# Altium project Jonathan ESC.PrjPcb
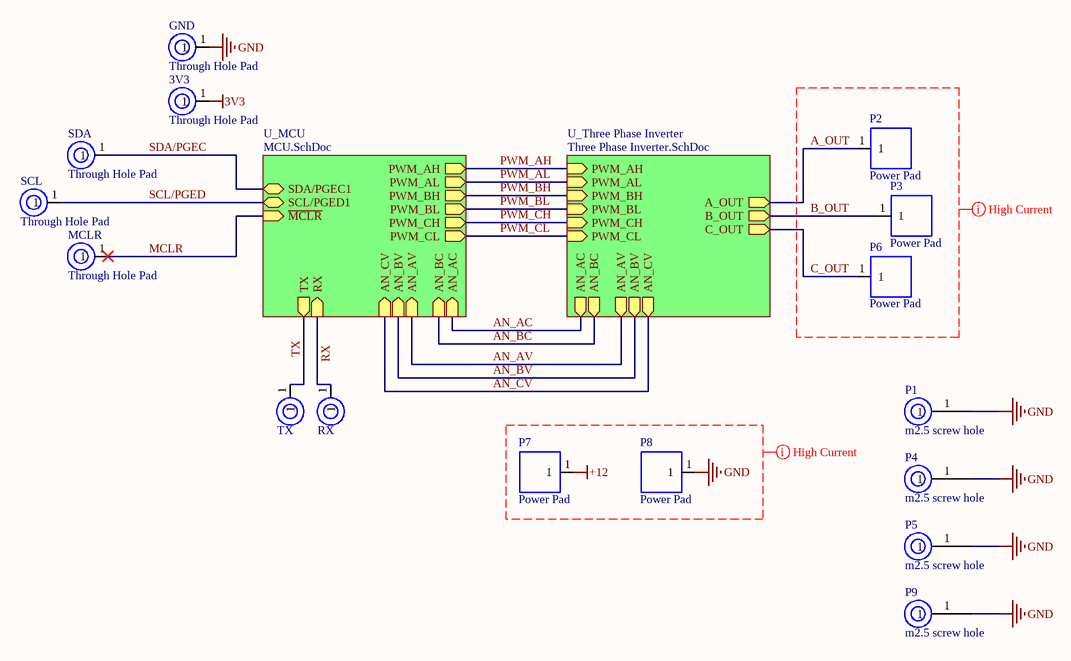
[diagram p0: Jonathan ESC.SchDoc]
3 sheets, 62 parts. Net scope: hierarchical (ports join the sheet entries above them; power ports are global).
Board file: Jonathan ESC.PcbDoc
Sheets:
  Jonathan ESC.SchDoc
    U_MCU = MCU.SchDoc
    U_Three Phase Inverter = Three Phase Inverter.SchDoc

## Sheet Jonathan ESC.SchDoc: Jonathan ESC Full
size A; Revision: 2.0; SheetNumber: 1; SheetTotal: 3

### Parts
3V3  Through Hole Pad  [THROUGH HOLE PAD]  (no BOM)
GND  Through Hole Pad  [THROUGH HOLE PAD]  (no BOM)
MCLR  Through Hole Pad  [THROUGH HOLE PAD]  (no BOM)
P1  m2.5 screw hole  [m2.5 screw hole]
P2  Power Pad  [Power Pad]  (no BOM)
P3  Power Pad  [Power Pad]  (no BOM)
P4  m2.5 screw hole  [m2.5 screw hole]
P5  m2.5 screw hole  [m2.5 screw hole]
P6  Power Pad  [Power Pad]  (no BOM)
P7  Power Pad  [Power Pad]  (no BOM)
P8  Power Pad  [Power Pad]  (no BOM)
P9  m2.5 screw hole  [m2.5 screw hole]
RX  RX  [THROUGH HOLE PAD]  (value not drawn)  (no BOM)
SCL  Through Hole Pad  [THROUGH HOLE PAD]  (no BOM)
SDA  Through Hole Pad  [THROUGH HOLE PAD]  (no BOM)
TX  TX  [THROUGH HOLE PAD]  (value not drawn)  (no BOM)

### Sub-sheets
U_MCU = MCU.SchDoc: SCL/PGED1 (bidir), SDA/PGEC1 (bidir), PWM_CL (out), PWM_AH (out), PWM_AL (out), PWM_BH (out), PWM_CH (out), PWM_BL (out), ~{MCLR} (in), AN_BV (in), AN_AV (in), AN_CV (in), AN_BC (in), AN_AC (in), TX (out), RX (in)
U_Three Phase Inverter = Three Phase Inverter.SchDoc: C_OUT (out), AN_AC (out), A_OUT (out), AN_BV (out), AN_BC (out), PWM_AL (in), B_OUT (out), PWM_BL (in), AN_CV (out), PWM_CL (in), PWM_AH (in), PWM_CH (in), AN_AV (out), PWM_BH (in)

### Nets
3V3: 3V3.1
+12: P7.1
GND: GND.1 P1.1 P4.1 P5.1 P8.1 P9.1
A_OUT: P2.1 ; sheet U_Three Phase Inverter/A_OUT
AN_AC: sheet U_MCU/AN_AC, sheet U_Three Phase Inverter/AN_AC
AN_AV: sheet U_MCU/AN_AV, sheet U_Three Phase Inverter/AN_AV
AN_BC: sheet U_MCU/AN_BC, sheet U_Three Phase Inverter/AN_BC
AN_BV: sheet U_MCU/AN_BV, sheet U_Three Phase Inverter/AN_BV
AN_CV: sheet U_MCU/AN_CV, sheet U_Three Phase Inverter/AN_CV
B_OUT: P3.1 ; sheet U_Three Phase Inverter/B_OUT
C_OUT: P6.1 ; sheet U_Three Phase Inverter/C_OUT
MCLR: MCLR.1 ; sheet U_MCU/~{MCLR}
PWM_AH: sheet U_MCU/PWM_AH, sheet U_Three Phase Inverter/PWM_AH
PWM_AL: sheet U_MCU/PWM_AL, sheet U_Three Phase Inverter/PWM_AL
PWM_BH: sheet U_MCU/PWM_BH, sheet U_Three Phase Inverter/PWM_BH
PWM_BL: sheet U_MCU/PWM_BL, sheet U_Three Phase Inverter/PWM_BL
PWM_CH: sheet U_MCU/PWM_CH, sheet U_Three Phase Inverter/PWM_CH
PWM_CL: sheet U_MCU/PWM_CL, sheet U_Three Phase Inverter/PWM_CL
RX: RX.1 ; sheet U_MCU/RX
SCL/PGED: SCL.1 ; sheet U_MCU/SCL/PGED1
SDA/PGEC: SDA.1 ; sheet U_MCU/SDA/PGEC1
TX: TX.1 ; sheet U_MCU/TX

### Layout directives
net class High Current: +12, A_OUT, B_OUT, C_OUT, GND

### Notes on the sheet
- Title
- Size:
- Date:
- A
- Number:
- Time:
- Revision:
- Sheet
- of
- File:

### Library data of the parts
RX TX = Through Hole Pad

## Sheet MCU.SchDoc: MCU
size A; Revision: 2.0; SheetNumber: 2; SheetTotal: 3
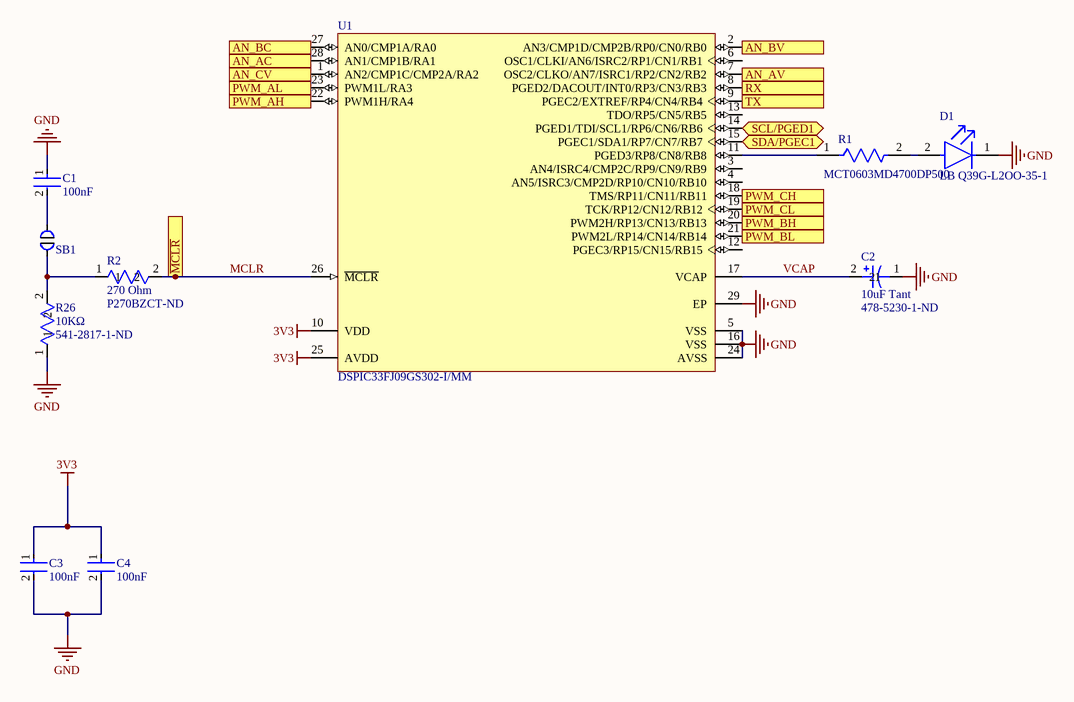
[diagram p1: MCU.SchDoc]

### Parts
C1  100nF  [FP-CL10-IPC_C]
C2  10uF Tant  Supplier Part Number 1: 478-5230-1-ND  [TPSB106K016R0500]
C3  100nF  [FP-CL10-IPC_C]
C4  100nF  [FP-CL10-IPC_C]
D1  LB Q39G-L2OO-35-1  [FP-LB_Q39G-MFG]
R1  MCT0603MD4700DP500  [FP-MCT0603-IPC_A]
R2  270 Ohm  Supplier Part Number 1: P270BZCT-ND  [ERJ-PA3J271V]
R26  10KΩ  Supplier Part Number 1: 541-2817-1-ND  [RCS060310K0JNEA]
SB1  Solder Bridge Open  [Solder Bridge Open]  (value not drawn)
U1  DSPIC33FJ09GS302-I/MM  [MCHP-QFN-S-MM28_M]

### Ports
AN_AC (in), AN_AV (in), AN_BC (in), AN_BV (in), AN_CV (in), PWM_AH (out), PWM_AL (out), PWM_BH (out), PWM_BL (out), PWM_CH (out), PWM_CL (out), RX (in), SCL/PGED1 (bidir), SDA/PGEC1 (bidir), TX (out), ~{MCLR} (in)

### Nets
3V3: C3.1 C4.1 U1.10(VDD) U1.25(AVDD)
GND: C1.1 C2.1 C3.2 C4.2 D1.1(C) R26.1 U1.5(VSS) U1.16(VSS) U1.24(AVSS) U1.29(EP)
AN_AC: U1.28(AN1/CMP1B/RA1) ; port AN_AC
AN_AV: U1.7(OSC2/CLKO/AN7/ISRC1/RP2/CN2/RB2) ; port AN_AV
AN_BC: U1.27(AN0/CMP1A/RA0) ; port AN_BC
AN_BV: U1.2(AN3/CMP1D/CMP2B/RP0/CN0/RB0) ; port AN_BV
AN_CV: U1.1(AN2/CMP1C/CMP2A/RA2) ; port AN_CV
MCLR: R2.2 U1.26(~{MCLR}) ; port ~{MCLR}
PWM_AH: U1.22(PWM1H/RA4) ; port PWM_AH
PWM_AL: U1.23(PWM1L/RA3) ; port PWM_AL
PWM_BH: U1.20(PWM2H/RP13/CN13/RB13) ; port PWM_BH
PWM_BL: U1.21(PWM2L/RP14/CN14/RB14) ; port PWM_BL
PWM_CH: U1.18(TMS/RP11/CN11/RB11) ; port PWM_CH
PWM_CL: U1.19(TCK/RP12/CN12/RB12) ; port PWM_CL
RX: U1.8(PGED2/DACOUT/INT0/RP3/CN3/RB3) ; port RX
SCL/PGED: U1.14(PGED1/TDI/SCL1/RP6/CN6/RB6) ; port SCL/PGED1
SDA/PGEC: U1.15(PGEC1/SDA1/RP7/CN7/RB7) ; port SDA/PGEC1
TX: U1.9(PGEC2/EXTREF/RP4/CN4/RB4) ; port TX
VCAP: C2.2 U1.17(VCAP)
NetC1_2: C1.2 SB1.1
NetD1_2: D1.2(A) R1.2
NetR1_1: R1.1 U1.11(PGED3/RP8/CN8/RB8)
NetR2_1: R2.1 R26.2 SB1.2

Not connected (* = marked no-connect by the designer): U1 3(AN4/ISRC4/CMP2C/RP9/CN9/RB9) 4(AN5/ISRC3/CMP2D/RP10/CN10/RB10) 6(OSC1/CLKI/AN6/ISRC2/RP1/CN1/RB1) 12(PGEC3/RP15/CN15/RB15) 13(TDO/RP5/CN5/RB5)

### Notes on the sheet
- Title
- Size:
- Date:
- A
- Number:
- Time:
- Revision:
- Sheet
- of
- File:

### Library data of the parts
C1 C3 C4 = CMP-13271-001724-1: Cap Ceramic 100nF 50V X7R ±20% Pad SMD 0603 +125°C T/R; Mount: Surface Mount; Lead Free: Lead Free; Max Operating Temperature: 125°C; Voltage Rating: 50V; Case Code (Imperial): 0603; Capacitance: 100nF; Height: 0.8mm; Length: 1.6mm; Tolerance: 20%; Case Code (Metric): 1608; Thickness: 0.035inch; Depth: 0.8mm; Width: 0.031inch; Package Quantity: 1; Min Operating Temperature: -55°C; Case/Package: 0603; Radiation Hardening: No; Voltage Rating (DC): 50V; Dielectric: X7R; Packaging: Tape and Reel
C2 = TPSB106K016R0500: CAP TANT 10UF 10% 16V SMD; Manufacturer: Kyocera AVX; Dielectric Material: Tantalum; ESR (Equivalent Series Resistance): 500mR; Leakage Current: 1.6uA; Polarity: Polar; Dissipation Factor: 6%; Supplier 1: Digi-Key; Manufacturer Part Number: TPSB106K016R0500; RoHS: Yes; Category: Tantalum Capacitors; Stock 1: 4; Pricing 1: 1=0.45000, 10=0.31900, 50=0.24140, 100=0.21030, 500=0.15580, 1000=0.13243 (USD); Mount: Surface Mount,PCB; Case/Package: 1210; Case Code (Metric): 3528; Case Code (Imperial): 1210; Min Operating Temperature: -55°C; Max Operating Temperature: 125°C; Capacitance: 10uF; Tolerance: 10%; Packaging: Tape and Reel; Package Quantity: 1; Voltage Rating: 16V; Voltage Rating (DC): 16V; Features: General Purpose; Termination: SMD/SMT; Voltage: 16V; Length: 3.5mm; Width: 0.11inch; Height: 1.9mm; Depth: 2.8mm; Height - Seated (Max): 0.083inch; Radiation Hardening: No; REACH SVHC: No SVHC; Lead Free: Lead Free; ComponentLink1URL: https://datasheet.ciiva.com/11793/0900766b80e0c35e-11793349.pdf?src-supplier=RSComponents; ComponentLink1Description: https://datasheet.ciiva.com/11793/0900766b80e0c35e-11793349.pdf?src-supplier=RSComponents; ComponentLink2URL: https://datasheet.ciiva.com/264/tps-264229.pdf?src-supplier=Digi-Key; ComponentLink2Description: https://datasheet.ciiva.com/264/tps-264229.pdf?src-supplier=Digi-Key; ComponentLink3URL: https://datasheet.ciiva.com/7730/1441576-7730869.pdf?src-supplier=Element14; ComponentLink3Description: https://datasheet.ciiva.com/7730/1441576-7730869.pdf?src-supplier=Element14; ComponentLink4URL: https://datasheet.ciiva.com/17339/tps-17339429.pdf?src-supplier=Avnet+Europe; ComponentLink4Description: https://datasheet.ciiva.com/17339/tps-17339429.pdf?src-supplier=Avnet+Europe; ComponentLink5URL: https://datasheet.ciiva.com/264/tps-264230.pdf?src-supplier=Digi-Key; ComponentLink5Description: https://datasheet.ciiva.com/264/tps-264230.pdf?src-supplier=Digi-Key; ComponentLink6URL: https://datasheet.ciiva.com/7730/1680477-7730870.pdf?src-supplier=Element14; ComponentLink6Description: https://datasheet.ciiva.com/7730/1680477-7730870.pdf?src-supplier=Element14; ComponentLink7URL: https://datasheet.ciiva.com/16500/tps-16500230.pdf?src-supplier=Future+Electronics; ComponentLink7Description: https://datasheet.ciiva.com/16500/tps-16500230.pdf?src-supplier=Future+Electronics; ComponentLink8URL: https://datasheet.ciiva.com/264/tps-264231.pdf?src-supplier=Digi-Key; ComponentLink8Description: https://datasheet.ciiva.com/264/tps-264231.pdf?src-supplier=Digi-Key; ComponentLink9URL: https://datasheet.ciiva.com/7730/1441576-7730871.pdf?src-supplier=Element14; ComponentLink9Description: https://datasheet.ciiva.com/7730/1441576-7730871.pdf?src-supplier=Element14; ComponentLink10URL: https://datasheet.ciiva.com/12882/tps-23028-12882919.pdf?src-supplier=Mouser; ComponentLink10Description: https://datasheet.ciiva.com/12882/tps-23028-12882919.pdf?src-supplier=Mouser; ComponentLink11URL: https://datasheet.ciiva.com/28609/packmark-28609112.pdf?src-supplier=Element14; ComponentLink11Description: https://datasheet.ciiva.com/28609/packmark-28609112.pdf?src-supplier=Element14; ComponentLink12URL: https://datasheet.ciiva.com/14599/70001047-14599898.pdf?src-supplier=Allied+Electronics; ComponentLink12Description: https://datasheet.ciiva.com/14599/70001047-14599898.pdf?src-supplier=Allied+Electronics; ComponentLink13URL: https://datasheet.ciiva.com/14605/70001047-14605902.pdf?src-supplier=Allied+Electronics; ComponentLink13Description: https://datasheet.ciiva.com/14605/70001047-14605902.pdf?src-supplier=Allied+Electronics
D1 = CMP-62016-000036-2: LED BLUE DIFFUSED 0603 SMD; Test Current: 5mA; Dominant Wavelength: 470nm; Number of LEDs: 1; Luminous Flux: 0.07lm; Viewing Angle: 135°; Lens Size: 0.8mm; Luminous Intensity: 29.5mcd; Lens Color: White; Lens Style: Flat; Forward Voltage: 2.85V; Lens Transparency: Diffused; Packaging: Tape and Reel; Case/Package: 0603; Series: CHIPLED 0603; Color: Blue; Height: 0.4mm; Mount: Surface Mount; Length: 1.6mm; Radiation Hardening: No; Case Code (Metric): 1608; Width: 0.8mm; Case Code (Imperial): 0603; Number of Pins: 2
R1 = CMP-02407-005707-1: RES SMD 100 OHM 1% 1/8W 0603; Power Rating: 125mW; Voltage Rating (DC): 75V; Max Power Dissipation: 150mW; Temperature Coefficient: 25ppm/°C; Resistance: 470R; Tolerance: 0.5%; Composition: Thin Film; Max Operating Temperature: 175°C; Termination: SMD/SMT; Case/Package: 0603; Number of Pins: 2; Packaging: Tape and Reel; Width: 0.033inch; REACH SVHC: No SVHC; Case Code (Metric): 1608; Voltage Rating: 75V; Features: Automotive AEC-Q200; Height: 0.022inch; Number of Terminations: 2; Case Code (Imperial): 0603; Package Quantity: 1; Length: 0.061inch; Min Operating Temperature: -55°C
R2 = ERJ-PA3J271V: Res Thick Film 0603 270 Ohm 5% 0.25W(1/4W) ±200ppm/C Pad SMD Automotive T/R; Manufacturer: Panasonic; Resistance: 270R; Max Power Dissipation: 250mW; Temperature Coefficient: 200ppm/°C; Supplier 1: Digi-Key; Manufacturer Part Number: ERJ-PA3J271V; RoHS: Yes; Category: Chip SMD Resistors; Stock 1: 14468; Pricing 1: 1=0.10000, 10=0.08600, 100=0.03300, 1000=0.01452, 2500=0.01254 (USD); Case/Package: 0603; Case Code (Imperial): 0603; Case Code (Metric): 1608; Min Operating Temperature: -55°C; Max Operating Temperature: 155°C; Tolerance: 5%; Features: Automotive AEC-Q200; Packaging: Tape and Reel; Resistor Type: Thick Film; Number of Terminations: 2; Length: 0.063inch; Width: 0.031inch; Height: 0.018inch; ComponentLink1URL: https://industrial.panasonic.com/cdbs/www-data/pdf/RDO0000/AOA0000C331.pdf?src-supplier=Digi-Key; ComponentLink1Description: https://industrial.panasonic.com/cdbs/www-data/pdf/RDO0000/AOA0000C331.pdf?src-supplier=Digi-Key; ComponentLink2URL: https://industrial.panasonic.com/ww/system/files/data/download/catalog/id_fixed-resistors_e_1.pdf?src-supplier=Digi-Key; ComponentLink2Description: https://industrial.panasonic.com/ww/system/files/data/download/catalog/id_fixed-resistors_e_1.pdf?src-supplier=Digi-Key
R26 = RCS060310K0JNEA: RES SMD 10K OHM 5% 1/4W 0603; Manufacturer: Vishay Dale; Max Power Dissipation: 250mW; Temperature Coefficient: 200ppm/°C; Resistance: 10kR; Supplier 1: Digi-Key; Manufacturer Part Number: RCS060310K0JNEA; RoHS: Yes; Category: Chip SMD Resistors; Stock 1: 1896; Pricing 1: 1=0.14000, 10=0.12900, 100=0.04950, 1000=0.02178, 2500=0.01881 (USD); Case/Package: 0603; Case Code (Imperial): 0603; Case Code (Metric): 1608; Min Operating Temperature: -55°C; Max Operating Temperature: 155°C; Tolerance: 5%; Features: Automotive AEC-Q200; Packaging: Tape and Reel; Resistor Type: Thick Film; Number of Terminations: 2; Length: 0.061inch; Width: 0.033inch; Height: 0.02inch; ComponentLink1URL: http://www.vishay.com/docs/20065/rcse3.pdf?src-supplier=Digi-Key; ComponentLink1Description: http://www.vishay.com/docs/20065/rcse3.pdf?src-supplier=Digi-Key
U1 = CMP-0045-00639-1: 16-Bit Microcontroller and Digital Signal Controller with High-Speed PWM, ADC and Comparator, 40 MIPS, 21 I/O, GPIO, -40 to 85 degC, 28-pin QFN (MM28), Tube; Manufacturer: Microchip; DatasheetVersion: Rev. C; ComponentLink2Description: Datasheet; ComponentLink4Description: Product URL; ComponentLink3URL: http://www.microchip.com/stellent/groups/techpub_sg/documents/packagingspec/en012702.pdf; PackageReference: QFN-MM28; Mounting Technology: Surface Mount; PartNumber: DSPIC33FJ09GS302-I/MM; ComponentLink4URL: http://www.microchip.com/dsPIC33FJ09GS302; ComponentLink2URL: http://ww1.microchip.com/downloads/en/DeviceDoc/75018c.pdf; PackageDescription: 28-Lead Plastic Quad Flat, 6 x 6 mm Body, 0.65 mm Pitch; PackageVersion: C04-124C; ComponentLink1Description: Manufacturer URL; ComponentLink3Description: Package Specification; ComponentLink1URL: http://www.microchip.com

## Sheet Three Phase Inverter.SchDoc: Three Phase Inverter
size A; Revision: 2.0; SheetNumber: 3; SheetTotal: 3
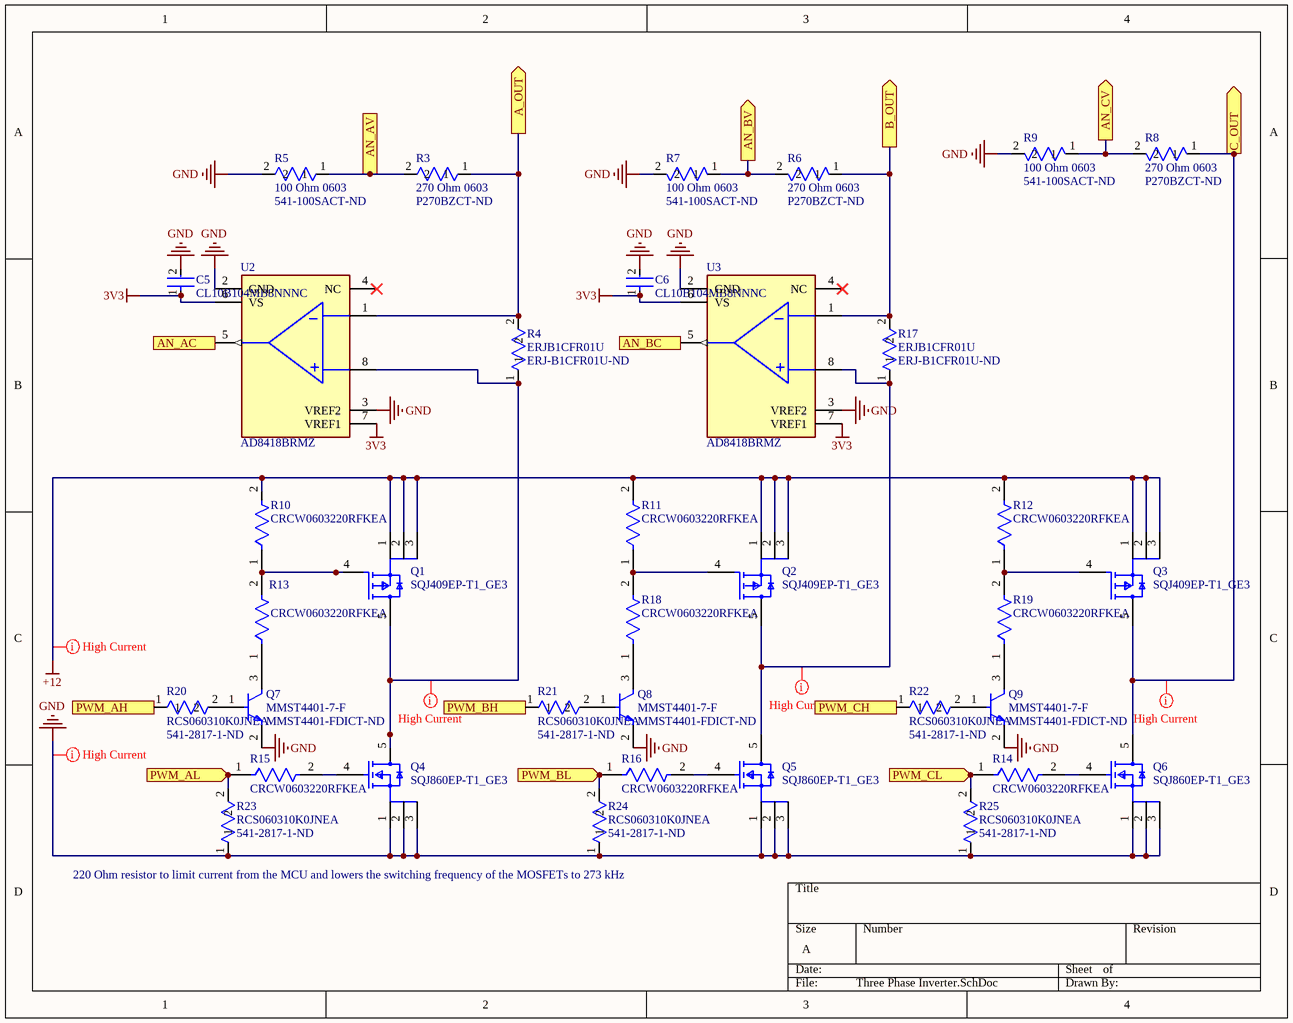
[diagram p2: Three Phase Inverter.SchDoc]

### Parts
C5  CL10B104MB8NNNC  [FP-CL10-IPC_C]
C6  CL10B104MB8NNNC  [FP-CL10-IPC_C]
Q1  SQJ409EP-T1_GE3  [SQJ409EP-T1_GE3]
Q2  SQJ409EP-T1_GE3  [SQJ409EP-T1_GE3]
Q3  SQJ409EP-T1_GE3  [SQJ409EP-T1_GE3]
Q4  SQJ860EP-T1_GE3  [SQJ860EP]
Q5  SQJ860EP-T1_GE3  [SQJ860EP]
Q6  SQJ860EP-T1_GE3  [SQJ860EP]
Q7  MMST4401-7-F  Supplier Part Number 1: MMST4401-FDICT-ND  [MMST4401-7-F]
Q8  MMST4401-7-F  Supplier Part Number 1: MMST4401-FDICT-ND  [MMST4401-7-F]
Q9  MMST4401-7-F  Supplier Part Number 1: MMST4401-FDICT-ND  [MMST4401-7-F]
R3  270 Ohm 0603  Supplier Part Number 1: P270BZCT-ND  [ERJ-PA3J271V]
R4  ERJB1CFR01U  Supplier Part Number 1: ERJ-B1CFR01U-ND  [ERJ-B1CFR01U]
R5  100 Ohm 0603  Supplier Part Number 1: 541-100SACT-ND  [CRCW0603100RJNEAHP]
R6  270 Ohm 0603  Supplier Part Number 1: P270BZCT-ND  [ERJ-PA3J271V]
R7  100 Ohm 0603  Supplier Part Number 1: 541-100SACT-ND  [CRCW0603100RJNEAHP]
R8  270 Ohm 0603  Supplier Part Number 1: P270BZCT-ND  [ERJ-PA3J271V]
R9  100 Ohm 0603  Supplier Part Number 1: 541-100SACT-ND  [CRCW0603100RJNEAHP]
R10  CRCW0603220RFKEA  [FP-CRCW0603-e3-MFG]
R11  CRCW0603220RFKEA  [FP-CRCW0603-e3-MFG]
R12  CRCW0603220RFKEA  [FP-CRCW0603-e3-MFG]
R13  CRCW0603220RFKEA  [FP-CRCW0603-e3-MFG]
R14  CRCW0603220RFKEA  [FP-CRCW0603-e3-MFG]
R15  CRCW0603220RFKEA  [FP-CRCW0603-e3-MFG]
R16  CRCW0603220RFKEA  [FP-CRCW0603-e3-MFG]
R17  ERJB1CFR01U  Supplier Part Number 1: ERJ-B1CFR01U-ND  [ERJ-B1CFR01U]
R18  CRCW0603220RFKEA  [FP-CRCW0603-e3-MFG]
R19  CRCW0603220RFKEA  [FP-CRCW0603-e3-MFG]
R20  RCS060310K0JNEA  Supplier Part Number 1: 541-2817-1-ND  [RCS060310K0JNEA]
R21  RCS060310K0JNEA  Supplier Part Number 1: 541-2817-1-ND  [RCS060310K0JNEA]
R22  RCS060310K0JNEA  Supplier Part Number 1: 541-2817-1-ND  [RCS060310K0JNEA]
R23  RCS060310K0JNEA  Supplier Part Number 1: 541-2817-1-ND  [RCS060310K0JNEA]
R24  RCS060310K0JNEA  Supplier Part Number 1: 541-2817-1-ND  [RCS060310K0JNEA]
R25  RCS060310K0JNEA  Supplier Part Number 1: 541-2817-1-ND  [RCS060310K0JNEA]
U2  AD8418BRMZ  [FP-RM-8-IPC_C]
U3  AD8418BRMZ  [FP-RM-8-IPC_C]

### Ports
A_OUT (out), AN_AC (out), AN_AV (out), AN_BC (out), AN_BV (out), AN_CV (out), B_OUT (out), C_OUT (out), PWM_AH (in), PWM_AL (in), PWM_BH (in), PWM_BL (in), PWM_CH (in), PWM_CL (in)

### Nets
3V3: C5.1 C6.1 U2.6(VS) U2.7(VREF1) U3.6(VS) U3.7(VREF1)
+12: Q1.1(S) Q1.2(S) Q1.3(S) Q2.1(S) Q2.2(S) Q2.3(S) Q3.1(S) Q3.2(S) Q3.3(S) R10.2 R11.2 R12.2
GND: C5.2 C6.2 Q4.1(S) Q4.2(S) Q4.3(S) Q5.1(S) Q5.2(S) Q5.3(S) Q6.1(S) Q6.2(S) Q6.3(S) Q7.2(E) Q8.2(E) Q9.2(E) R5.2 R7.2 R9.2 R23.1 R24.1 R25.1 U2.2(GND) U2.3(VREF2) U3.2(GND) U3.3(VREF2)
A_OUT: R3.1 R4.2 U2.1(-IN) ; port A_OUT
AN_AC: U2.5(OUT) ; port AN_AC
AN_AV: R3.2 R5.1 ; port AN_AV
AN_BC: U3.5(OUT) ; port AN_BC
AN_BV: R6.2 R7.1 ; port AN_BV
AN_CV: R8.2 R9.1 ; port AN_CV
B_OUT: R6.1 R17.2 U3.1(-IN) ; port B_OUT
C_OUT: Q3.5(D) Q6.5(D) R8.1 ; port C_OUT
PWM_AH: R20.1 ; port PWM_AH
PWM_AL: R15.1 R23.2 ; port PWM_AL
PWM_BH: R21.1 ; port PWM_BH
PWM_BL: R16.1 R24.2 ; port PWM_BL
PWM_CH: R22.1 ; port PWM_CH
PWM_CL: R14.1 R25.2 ; port PWM_CL
NetQ1_4: Q1.4(G) R10.1 R13.2
NetQ1_5: Q1.5(D) Q4.5(D) R4.1 U2.8(+IN)
NetQ2_4: Q2.4(G) R11.1 R18.2
NetQ2_5: Q2.5(D) Q5.5(D) R17.1 U3.8(+IN)
NetQ3_4: Q3.4(G) R12.1 R19.2
NetQ4_4: Q4.4(G) R15.2
NetQ5_4: Q5.4(G) R16.2
NetQ6_4: Q6.4(G) R14.2
NetQ7_1: Q7.1(B) R20.2
NetQ7_3: Q7.3(C) R13.1
NetQ8_1: Q8.1(B) R21.2
NetQ8_3: Q8.3(C) R18.1
NetQ9_1: Q9.1(B) R22.2
NetQ9_3: Q9.3(C) R19.1

Not connected (* = marked no-connect by the designer): U2 4(NC)*; U3 4(NC)*

### Layout directives
net class High Current: +12, C_OUT, GND, NetQ1_5, NetQ2_5

### Notes on the sheet
- 220 Ohm resistor to limit current from the MCU and lowers the switching frequency of the MOSFETs to 273 kHz
- Title
- Size:
- Date:
- A
- Number:
- Time:
- Revision:
- Sheet
- of
- File:

### Library data of the parts
C5 C6 = CMP-13271-001724-1: as C1 on sheet MCU; Mount: Surface Mount; Lead Free: Lead Free; Max Operating Temperature: 125°C; Voltage Rating: 50V; Case Code (Imperial): 0603; Capacitance: 100nF; Height: 0.8mm; Length: 1.6mm; Tolerance: 20%; Case Code (Metric): 1608; Thickness: 0.035inch; Depth: 0.8mm; Width: 0.031inch; Package Quantity: 1; Min Operating Temperature: -55°C; Case/Package: 0603; Radiation Hardening: No; Voltage Rating (DC): 50V; Dielectric: X7R; Packaging: Tape and Reel
Q4-Q6 = SQJ860EP-T1_GE3: RESET GENERATOR SOT23; Manufacturer: Vishay; Supplier 1: Digi-Key; Manufacturer Part Number: SQJ860EP-T1_GE3; RoHS: No; Category: MOSFETs; Stock 1: 12489; Pricing 1: 1=0.92000, 10=0.79400, 25=0.75720, 100=0.54940, 500=0.45910, 1000=0.39072 (USD); Supplier Part Number 1: SQJ860EP-T1_GE3CT-ND
Q7-Q9 = MMST4401-7-F: TRANS NPN 40V 0.6A SC70-3; Manufacturer: Diodes; Max Power Dissipation: 200mW; Collector Base Voltage (VCBO): 60V; Max Collector Current: 600mA; hFE Min: 20; Frequency: 250MHz; Emitter Base Voltage (VEBO): 6V; Number of Elements: 1; Element Configuration: Single; Collector-emitter Voltage-Max: 750mV; Supplier 1: Digi-Key; Manufacturer Part Number: MMST4401-7-F; RoHS: Yes; Category: BJTs; Stock 1: 2577; Pricing 1: 1=0.25000, 10=0.20500, 25=0.17160, 100=0.10880, 500=0.07156, 1000=0.04865 (USD); Mount: Surface Mount; Case/Package: SOT-323; Number of Pins: 3; Weight: 0.000212oz; Min Operating Temperature: -55°C; Max Operating Temperature: 150°C; Collector Emitter Voltage (VCEO): 40V; Polarity: NPN; Packaging: Tape and Reel; Package Quantity: 3000; Collector Emitter Breakdown Voltage: 40V; Transition Frequency: 250MHz; Max Breakdown Voltage: 40V; Power Dissipation: 200mW; Max Frequency: 250MHz; Gain Bandwidth Product: 250MHz; Voltage Rating (DC): 40V; Current Rating: 600mA; Series: -; Length: 2.2mm; Width: 1.35mm; Height: 1mm; Radiation Hardening: No; REACH SVHC: No SVHC; Lead Free: Lead Free; ComponentLink1URL: https://datasheet.ciiva.com/5782/ds30084-5782785.pdf?src-supplier=Avnet; ComponentLink1Description: https://datasheet.ciiva.com/5782/ds30084-5782785.pdf?src-supplier=Avnet; ComponentLink2URL: https://datasheet.ciiva.com/5782/ds30084-5782785.pdf?src-supplier=Farnell; ComponentLink2Description: https://datasheet.ciiva.com/5782/ds30084-5782785.pdf?src-supplier=Farnell; ComponentLink3URL: https://datasheet.ciiva.com/26943/getdatasheetpartid-157337-26943118.pdf?src-supplier=Verical; ComponentLink3Description: https://datasheet.ciiva.com/26943/getdatasheetpartid-157337-26943118.pdf?src-supplier=Verical; ComponentLink4URL: https://datasheet.ciiva.com/17302/ds30084-17302987.pdf?src-supplier=Avnet+Europe; ComponentLink4Description: https://datasheet.ciiva.com/17302/ds30084-17302987.pdf?src-supplier=Avnet+Europe
R3 R6 R8 = ERJ-PA3J271V: as R2 on sheet MCU; Supplier 1: Digi-Key; Manufacturer Part Number: ERJ-PA3J271V; RoHS: Yes; Category: Chip SMD Resistors; Stock 1: 14468; Pricing 1: 1=0.10000, 10=0.08600, 100=0.03300, 1000=0.01452, 2500=0.01254 (USD); Case/Package: 0603; Case Code (Imperial): 0603; Case Code (Metric): 1608; Min Operating Temperature: -55°C; Max Operating Temperature: 155°C; Tolerance: 5%; Features: Automotive AEC-Q200; Packaging: Tape and Reel; Resistor Type: Thick Film; Number of Terminations: 2; Length: 0.063inch; Width: 0.031inch; Height: 0.018inch; ComponentLink1URL: https://industrial.panasonic.com/cdbs/www-data/pdf/RDO0000/AOA0000C331.pdf?src-supplier=Digi-Key; ComponentLink1Description: https://industrial.panasonic.com/cdbs/www-data/pdf/RDO0000/AOA0000C331.pdf?src-supplier=Digi-Key; ComponentLink2URL: https://industrial.panasonic.com/ww/system/files/data/download/catalog/id_fixed-resistors_e_1.pdf?src-supplier=Digi-Key; ComponentLink2Description: https://industrial.panasonic.com/ww/system/files/data/download/catalog/id_fixed-resistors_e_1.pdf?src-supplier=Digi-Key
R4 R17 = ERJB1CFR01U: Res Thick Film 1020 0.01 Ohm 1% 2W ±350ppm/°C Molded SMD Embossed Carrier T/R; Manufacturer: Panasonic; Resistance: 10mR; Voltage Rating: 200V; Supplier 1: Digi-Key; Manufacturer Part Number: ERJB1CFR01U; RoHS: Yes; Category: Chip SMD Resistors; Pricing 1: 5000=0.51892 (USD); Mount: Surface Mount; Case/Package: 2010; Contact Plating: Tin; Case Code (Metric): 2550; Case Code (Imperial): 1020; Min Operating Temperature: -55°C; Max Operating Temperature: 155°C; Power Rating: 2W; Tolerance: 1%; Resistor Type: Thick Film; Temperature Coefficient: 350ppm/°C; Packaging: Tape and Reel; Package Quantity: 5000; Number of Terminations: 2; Max Power Dissipation: 2W; Voltage Rating (DC): 200V; Series: ERJ; Resistance Tolerance: 1%; Construction: Rectangular; Length: 2.5mm; Width: 0.197inch; Height: 0.03inch; Depth: 5mm; Radiation Hardening: No; REACH SVHC: No SVHC; Military Standard: Not; RoHS Compliant: Yes; ComponentLink1URL: https://datasheet.ciiva.com/43466/1688501-43466679.pdf?src-supplier=Farnell; ComponentLink1Description: https://datasheet.ciiva.com/43466/1688501-43466679.pdf?src-supplier=Farnell; ComponentLink2URL: https://datasheet.ciiva.com/46383/1688501-46383655.pdf?src-supplier=Element14; ComponentLink2Description: https://datasheet.ciiva.com/46383/1688501-46383655.pdf?src-supplier=Element14; ComponentLink3URL: https://datasheet.ciiva.com/46375/1688501-46375722.pdf?src-supplier=Element14; ComponentLink3Description: https://datasheet.ciiva.com/46375/1688501-46375722.pdf?src-supplier=Element14; ComponentLink4URL: https://datasheet.ciiva.com/9194/aoa0000ce23-9194124.pdf?src-supplier=Avnet; ComponentLink4Description: https://datasheet.ciiva.com/9194/aoa0000ce23-9194124.pdf?src-supplier=Avnet
R5 R7 R9 = CRCW0603100RJNEAHP: Res Thick Film 0603 100 Ohm 5% 1/4W 200ppm/C Molded SMD SMD Paper T/R; Manufacturer: Vishay Dale; Resistance: 100R; Temperature Coefficient: 200ppm/°C; Power Rating: 250mW; Voltage Rating: 75V; Supplier 1: Digi-Key; Manufacturer Part Number: CRCW0603100RJNEAHP; RoHS: Yes; Category: Chip SMD Resistors; Stock 1: 23670; Pricing 1: 1=0.15000, 10=0.12900, 100=0.05060, 1000=0.02119, 2500=0.01942 (USD); Mount: Surface Mount; Case/Package: 0603; Case Code (Imperial): 0603; Case Code (Metric): 1608; Contact Plating: Tin; Weight: 7.1E-05oz; Min Operating Temperature: -55°C; Max Operating Temperature: 155°C; Tolerance: 5%; Packaging: Tape and Reel; Resistor Type: Thick Film; Series: CRCW-HP; Number of Terminations: 2; Package Quantity: 5000; Max Power Dissipation: 250mW; Termination: SMD/SMT; Construction: Rectangular; Features: Automotive AEC-Q200; Length: 1.6mm; Width: 0.8mm; Height: 0.45mm; Depth: 0.85mm; Radiation Hardening: No; RoHS Compliant: Yes; Military Standard: Not; Lead Free: Lead Free; ComponentLink1URL: https://datasheet.ciiva.com/5562/crcwhpe3-46056-5562229.pdf?src-supplier=Mouser; ComponentLink1Description: https://datasheet.ciiva.com/5562/crcwhpe3-46056-5562229.pdf?src-supplier=Mouser; ComponentLink2URL: https://datasheet.ciiva.com/8979/crcwhpe3-8979829.pdf?src-supplier=Avnet; ComponentLink2Description: https://datasheet.ciiva.com/8979/crcwhpe3-8979829.pdf?src-supplier=Avnet; ComponentLink3URL: https://datasheet.ciiva.com/16886/crcwhpe3-16886006.pdf?src-supplier=Avnet+Europe; ComponentLink3Description: https://datasheet.ciiva.com/16886/crcwhpe3-16886006.pdf?src-supplier=Avnet+Europe
R10-R16 R18 R19 = CMP-2000-03085-2: RES Thick Film, 220Ω, 1%, 0.1W, 100ppm/°C, 0603; Power Rating: 100mW; Voltage Rating: 75V; Resistance: 220R; Contact Plating: Tin; Package Quantity: 10; Lead Free: Lead Free; Packaging: Tape and Reel; Max Operating Temperature: 155°C; Case/Package: 0603; Radiation Hardening: No; Height: 0.45mm; Width: 0.033inch; Case Code (Imperial): 0603; Number of Terminations: 2; Tolerance: 1%; Min Operating Temperature: -55°C; Termination: SMD/SMT; Length: 1.55mm; Features: Automotive AEC-Q200; Voltage Rating (DC): 75V; Case Code (Metric): 1608; Composition: Thick Film; Military Standard: Not; Temperature Coefficient: 100ppm/°C; Depth: 0.85mm; Weight: 7.1E-05oz; Max Power Dissipation: 100mW
R20-R25 = RCS060310K0JNEA: as R26 on sheet MCU; Supplier 1: Digi-Key; Manufacturer Part Number: RCS060310K0JNEA; RoHS: Yes; Category: Chip SMD Resistors; Stock 1: 1896; Pricing 1: 1=0.14000, 10=0.12900, 100=0.04950, 1000=0.02178, 2500=0.01881 (USD); Case/Package: 0603; Case Code (Imperial): 0603; Case Code (Metric): 1608; Min Operating Temperature: -55°C; Max Operating Temperature: 155°C; Tolerance: 5%; Features: Automotive AEC-Q200; Packaging: Tape and Reel; Resistor Type: Thick Film; Number of Terminations: 2; Length: 0.061inch; Width: 0.033inch; Height: 0.02inch; ComponentLink1URL: http://www.vishay.com/docs/20065/rcse3.pdf?src-supplier=Digi-Key; ComponentLink1Description: http://www.vishay.com/docs/20065/rcse3.pdf?src-supplier=Digi-Key
U2 U3 = CMP-09116-000026-1: IC CURR SENSE 1 CIRCUIT 8MSOP; Manufacturer: Analog Devices; Min Supply Voltage: 2.7V; Input Bias Current: 130uA; Number Of Channels: 1; Max Supply Voltage: 5.5V; Voltage Gain: 0.02V/mV; Bandwidth: 250kHz; Standoff Height: 0.05mm; Nominal Supply Current: 2.6mA; Input Offset Voltage: 0.2mV; Automotive: No; Temperature: -40°C to +125°C; Octopart: https://octopart.com/ad8418brmz-analog+devices-21054230; ComponentLink2Description: Datasheet; Device Class L1: Integrated Circuits (ICs); ComponentLink2URL: https://www.analog.com/media/en/technical-documentation/data-sheets/AD8418.pdf; Digikey Description: IC CURR SENSE 1 CIRCUIT 8MSOP; Ipc Land Pattern Name: SOP65P490X110-8; Temperature Range Low: -40°C; Device Class L3: Instrumentation; Height: 1.1mm; Mouser Description: Current Sense Amplifier, Bidirectional, 1, 130 A, MSOP, 8, -40 C, 125 C; Lead Free: Yes; Manufacturer Part Number: AD8418BRMZ; Category: IC; Package: RM-8; Device Class L2: Linear ICs; Temperature Range High: +125°C; RoHS: TRUE

## Nets that join several sheets
3V3: Jonathan ESC (3V3.1), MCU (C3.1 C4.1 U1.10 U1.25), Three Phase Inverter (6 pins)
+12: Jonathan ESC (P7.1), Three Phase Inverter (12 pins)
GND: Jonathan ESC (6 pins), MCU (10 pins), Three Phase Inverter (24 pins)
A_OUT: Jonathan ESC (P2.1), Three Phase Inverter (R3.1 R4.2 U2.1)
AN_AC: MCU (U1.28), Three Phase Inverter (U2.5)
AN_AV: MCU (U1.7), Three Phase Inverter (R3.2 R5.1)
AN_BC: MCU (U1.27), Three Phase Inverter (U3.5)
AN_BV: MCU (U1.2), Three Phase Inverter (R6.2 R7.1)
AN_CV: MCU (U1.1), Three Phase Inverter (R8.2 R9.1)
B_OUT: Jonathan ESC (P3.1), Three Phase Inverter (R6.1 R17.2 U3.1)
C_OUT: Jonathan ESC (P6.1), Three Phase Inverter (Q3.5 Q6.5 R8.1)
MCLR: Jonathan ESC (MCLR.1), MCU (R2.2 U1.26)
PWM_AH: MCU (U1.22), Three Phase Inverter (R20.1)
PWM_AL: MCU (U1.23), Three Phase Inverter (R15.1 R23.2)
PWM_BH: MCU (U1.20), Three Phase Inverter (R21.1)
PWM_BL: MCU (U1.21), Three Phase Inverter (R16.1 R24.2)
PWM_CH: MCU (U1.18), Three Phase Inverter (R22.1)
PWM_CL: MCU (U1.19), Three Phase Inverter (R14.1 R25.2)
RX: Jonathan ESC (RX.1), MCU (U1.8)
SCL/PGED: Jonathan ESC (SCL.1), MCU (U1.14)
SDA/PGEC: Jonathan ESC (SDA.1), MCU (U1.15)
TX: Jonathan ESC (TX.1), MCU (U1.9)